# EAGLE design dronesel5 (EAGLE 9.6.2)
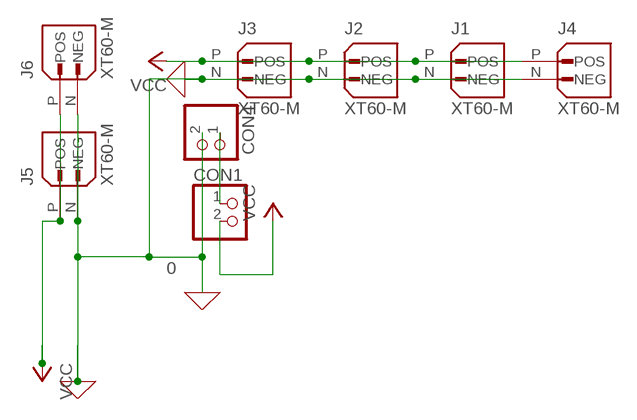
[diagram p0: schematic, sheet 1]

## Parts
CON1  L2  [L_2]
CON4  L2  [L_2]
J1  XT60-M  [AMASS_XT60-M]
J2  XT60-M  [AMASS_XT60-M]
J3  XT60-M  [AMASS_XT60-M]
J4  XT60-M  [AMASS_XT60-M]
J5  XT60-M  [AMASS_XT60-M]
J6  XT60-M  [AMASS_XT60-M]

## Nets
0: CON4.2 J1.N(NEG) J2.N(NEG) J3.N(NEG) J4.N(NEG) J5.N(NEG) J6.N(NEG) ; supply symbol labelled GND
N$1: CON1.1(GND) CON4.1(GND)
VCC: CON1.2 J1.P(POS) J2.P(POS) J3.P(POS) J4.P(POS) J5.P(POS) J6.P(POS)

## Library data of the parts
CON1 CON4 = CREATE_sensor_dip:L2
J1-J6 = XT60-M:XT60-M: Check availability <https://pricing.snapeda.com/parts/XT60-M/AMASS/view-part?ref=eda>; AVAILABILITY: Not in stock; CHECK_PRICES: https://www.snapeda.com/parts/XT60-M/AMASS/view-part/?ref=eda; DESCRIPTION: Plug; DC supply; XT60; male; PIN: 2; for cable; soldered; 30A; 500V; MF: AMASS; MP: XT60-M; PACKAGE: Package; PRICE: None; SNAPEDA_LINK: https://www.snapeda.com/parts/XT60-M/AMASS/view-part/?ref=snap

## Board
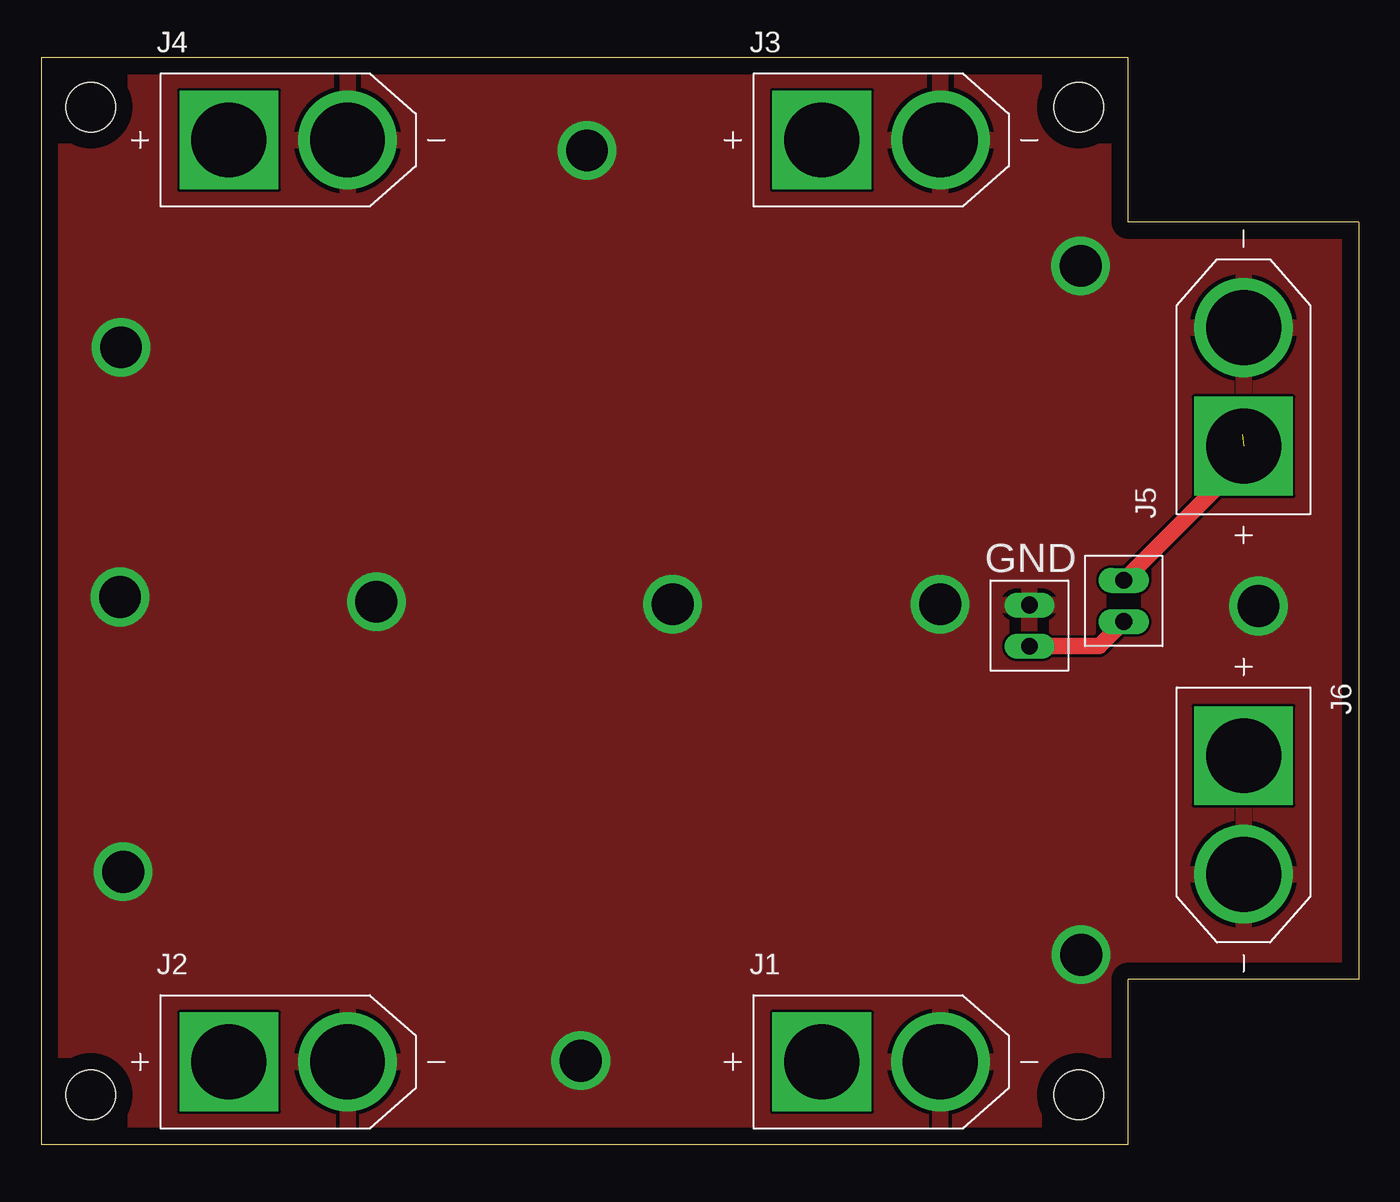
[diagram p1: board, top side]
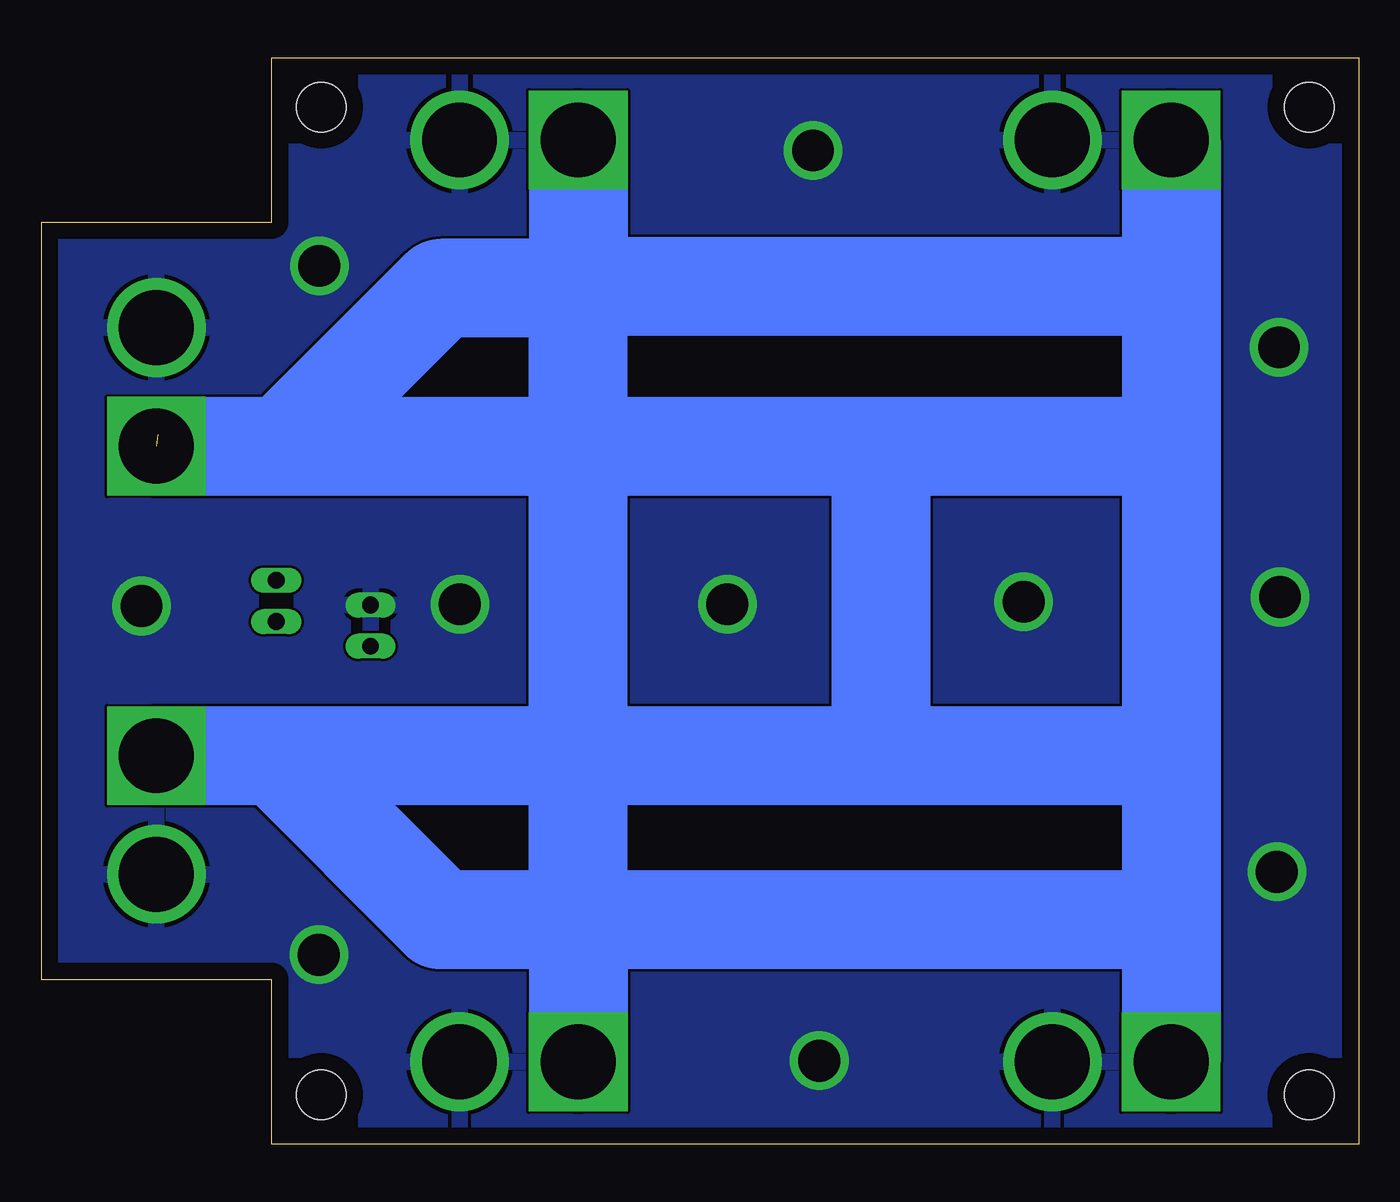
[diagram p2: board, bottom side, seen from below]

Size 80 x 66 mm. Coordinates in mm from the lower left corner, seen from the top.
Outline: 0,0 66,0 66,10 80,10 80,56 66,56 66,66 0,66 0,0
Copper layers (1*16): Top 0.035mm / dielectric 1.5mm / Bottom 0.035mm
Design rules "default": minimum track width 6mil, minimum drill 0.35mm, track to track 6mil, track to pad 6mil, pad to pad 6mil, via to via 6mil, smd to smd 6mil, copper to edge 40mil, drill to drill 6mil, minimum pad ring 10mil, minimum via ring 8mil, stop-mask expansion 4mil, vias tented up to drill 0mil, thermal gap 10mil
Holes 3 mm at 3,3 63,3 63,63 3,63

### Footprints (pad centres in the part's own frame; a part is rotated, then mirrored left to right if it is on the bottom)
L_2 = drill 1.016 long: 1 1.25,0; 2 -1.25,0
AMASS_XT60-M = drill 4.55 pad 6: N 3.6,0 | drill 4.55 pad 6 square: P -3.6,0

### Placement (x,y rotation side)
CON1  65.73,33 270 top
CON4  60,31.5 270 top
J1  51,5 0 top
J2  15,5 0 top
J3  51,61 0 top
J4  15,61 0 top
J5  73,46 90 top
J6  73,20 270 top

### Tracks (layer width: path | path; a pad name or v marks a point on that pad's centre or on a via)
0  (via drill 2.54)
  other vias: 38.34,32.8 20.35,32.95 32.76,5.07 33.14,60.36 63.11,53.35 63.14,11.51 73.91,32.69 54.58,32.8 4.79,33.24 4.98,16.55 4.85,48.4
  pour Bottom: -3.73,66 -3.73,-1.45 66,-1.45 66,10 80.56,10 80.56,56 66,56 66,66
  pour Top: 66,-0.29 -1.76,-0.29 -1.76,67.26 66,67.26 66,56 82.02,56 82.02,10 66,10
N$1
  Top 1.016: CON4.1 64.23,30.25 CON1.1
VCC  (1 unrouted)
  Top 1.016: CON1.2 72.91,41.43 72.91,43.11
  Bottom 6: J4.P 11.4,52.1 | 11.4,52.1 11.4,42.71 | 11.4,42.71 11.4,23.59 | 11.4,23.59 11.4,13.64 | 11.4,13.64 J2.P | J3.P 47.4,51.99 | 47.4,14.2 47.4,51.99 | 47.4,14.2 J1.P | J6.P 29.32,23.6 | 29.32,23.6 11.41,23.6 11.4,23.59 | J5.P 65.33,42.4 | 65.33,42.4 29.04,42.4 | 29.04,42.4 11.71,42.4 11.4,42.71 | 29.04,42.4 29.04,23.88 29.32,23.6 | 11.4,13.64 46.84,13.64 | 47.4,14.2 46.84,13.64 | 11.4,52.1 47.29,52.1 47.4,51.99 | 47.4,51.99 55.74,51.99 65.33,42.4 | 46.84,13.64 55.78,13.64 65.62,23.48

### Text on the board
tPlace: GND